# EAGLE design W520B (EAGLE 6.6.0)
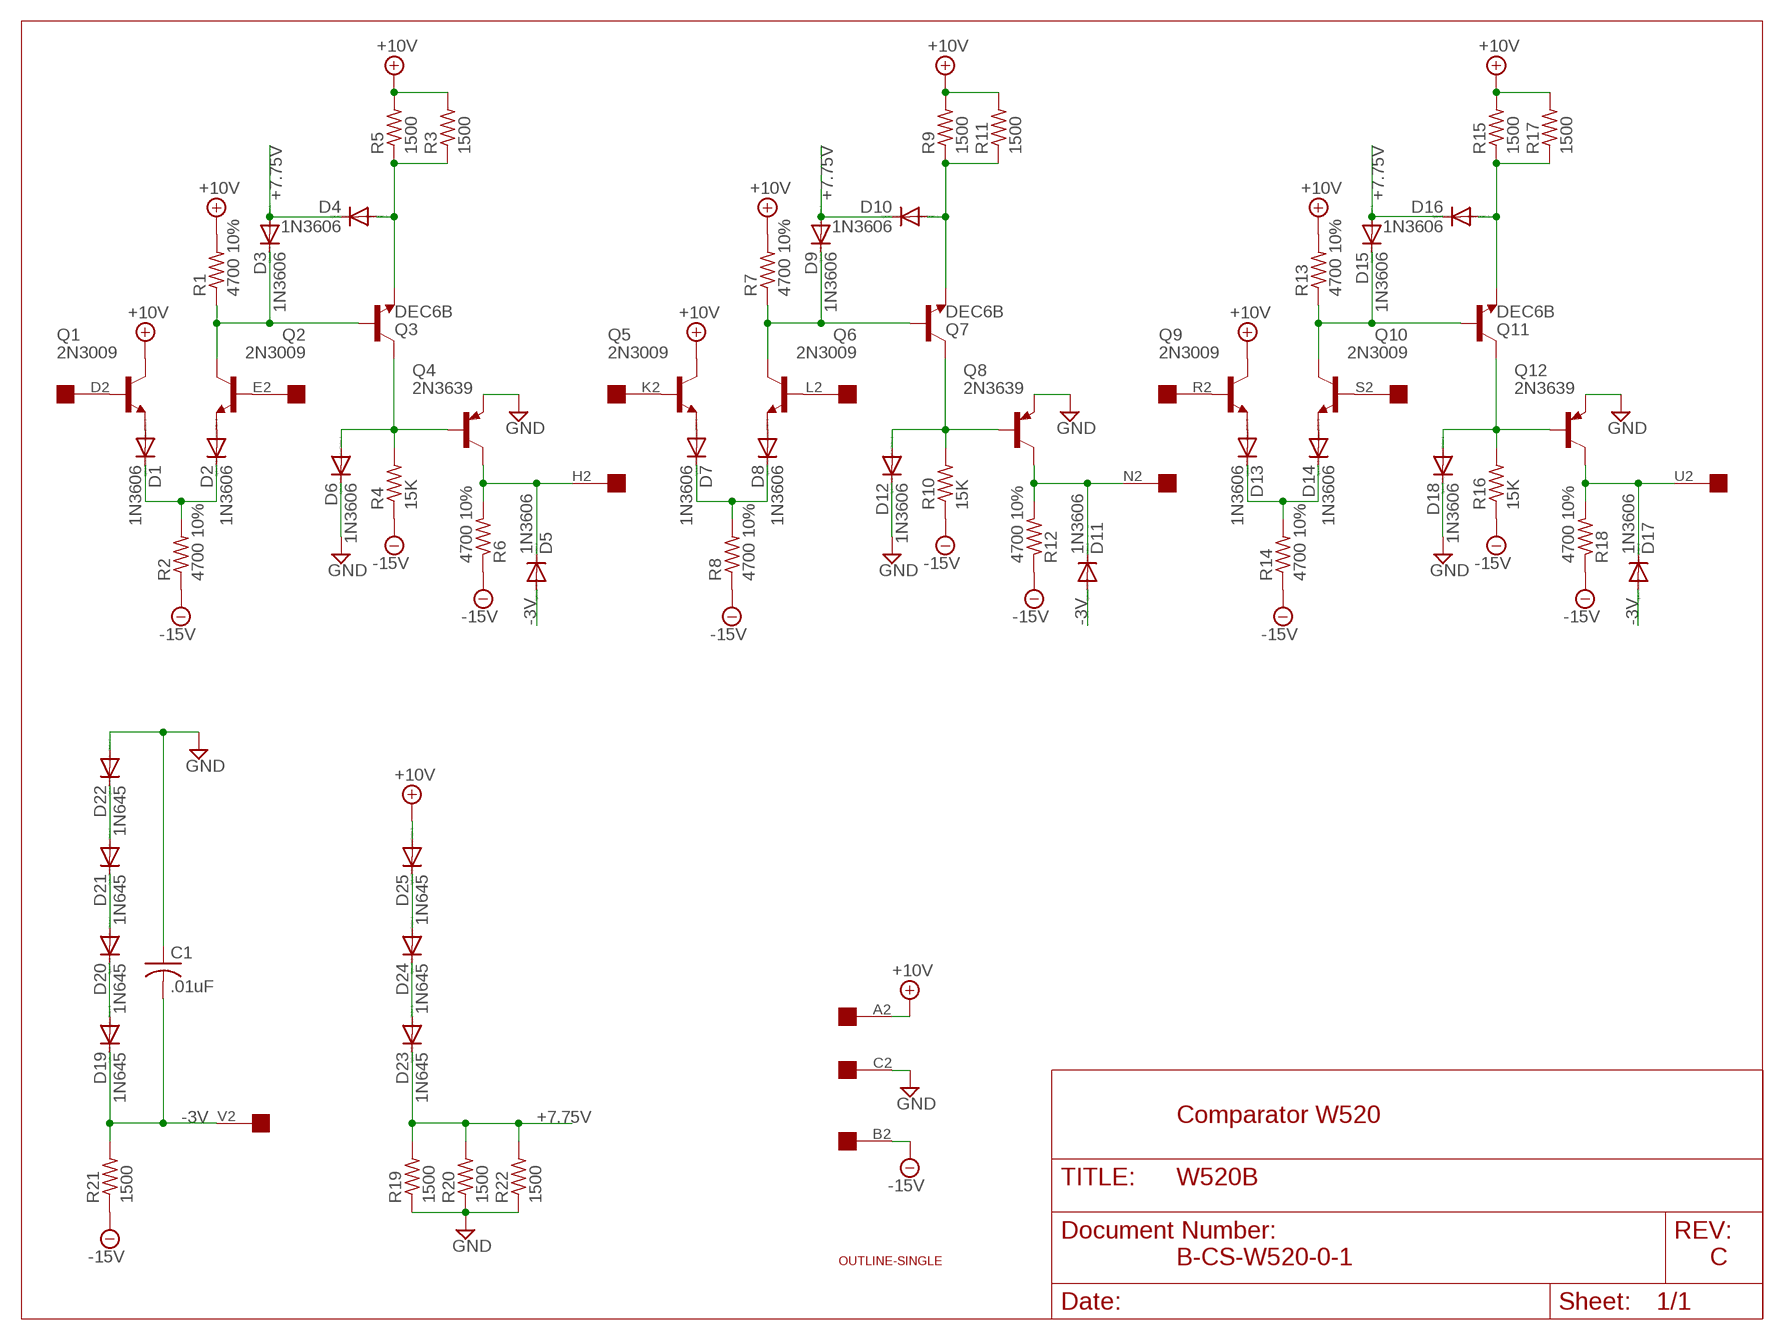
[diagram p0: schematic, sheet 1]

## Parts
C1  .01uF  C-US150-054X183  [C150-054X183]
D1  1N3606  1N4148DO35-10  [DO35-10]
D2  1N3606  1N4148DO35-10  [DO35-10]
D3  1N3606  1N4148DO35-10  [DO35-10]
D4  1N3606  1N4148DO35-10  [DO35-10]
D5  1N3606  1N4148DO35-10  [DO35-10]
D6  1N3606  1N4148DO35-10  [DO35-10]
D7  1N3606  1N4148DO35-10  [DO35-10]
D8  1N3606  1N4148DO35-10  [DO35-10]
D9  1N3606  1N4148DO35-10  [DO35-10]
D10  1N3606  1N4148DO35-10  [DO35-10]
D11  1N3606  1N4148DO35-10  [DO35-10]
D12  1N3606  1N4148DO35-10  [DO35-10]
D13  1N3606  1N4148DO35-10  [DO35-10]
D14  1N3606  1N4148DO35-10  [DO35-10]
D15  1N3606  1N4148DO35-10  [DO35-10]
D16  1N3606  1N4148DO35-10  [DO35-10]
D17  1N3606  1N4148DO35-10  [DO35-10]
D18  1N3606  1N4148DO35-10  [DO35-10]
D19  1N645  1N4148DO35-10  [DO35-10]
D20  1N645  1N4148DO35-10  [DO35-10]
D21  1N645  1N4148DO35-10  [DO35-10]
D22  1N645  1N4148DO35-10  [DO35-10]
D23  1N645  1N4148DO35-10  [DO35-10]
D24  1N645  1N4148DO35-10  [DO35-10]
D25  1N645  1N4148DO35-10  [DO35-10]
Q1  2N3009  2N2102  [TO5]
Q2  2N3009  2N2102  [TO5]
Q3  DEC6B  2N2102  [TO5]
Q4  2N3639  2N2904  [TO39]
Q5  2N3009  2N2102  [TO5]
Q6  2N3009  2N2102  [TO5]
Q7  DEC6B  2N2102  [TO5]
Q8  2N3639  2N2904  [TO39]
Q9  2N3009  2N2102  [TO5]
Q10  2N3009  2N2102  [TO5]
Q11  DEC6B  2N2102  [TO5]
Q12  2N3639  2N2904  [TO39]
R1  4700 10%  R-US_0207/10  [0207/10]
R2  4700 10%  R-US_0207/10  [0207/10]
R3  1500  R-US_0207/10  [0207/10]
R4  15K  R-US_0207/10  [0207/10]
R5  1500  R-US_0207/10  [0207/10]
R6  4700 10%  R-US_0207/10  [0207/10]
R7  4700 10%  R-US_0207/10  [0207/10]
R8  4700 10%  R-US_0207/10  [0207/10]
R9  1500  R-US_0207/10  [0207/10]
R10  15K  R-US_0207/10  [0207/10]
R11  1500  R-US_0207/10  [0207/10]
R12  4700 10%  R-US_0207/10  [0207/10]
R13  4700 10%  R-US_0207/10  [0207/10]
R14  4700 10%  R-US_0207/10  [0207/10]
R15  1500  R-US_0207/10  [0207/10]
R16  15K  R-US_0207/10  [0207/10]
R17  1500  R-US_0207/10  [0207/10]
R18  4700 10%  R-US_0207/10  [0207/10]
R19  1500  R-US_0207/10  [0207/10]
R20  1500  R-US_0207/10  [0207/10]
R21  1500  R-US_0207/10  [0207/10]
R22  1500  R-US_0207/10  [0207/10]
U$1  OUTLINE-SINGLE  [SINGLE]
U$2  EDGE-1  [EDGE-CON1]

## Nets
+7.75V: D3.A D4.C D9.A D10.C D15.A D16.C D23.C R19.2 R20.2 R22.2
+10V [Supply]: D25.A Q1.3(C) Q5.3(C) Q9.3(C) R1.2 R3.2 R5.2 R7.2 R9.2 R11.2 R13.2 R15.2 R17.2 U$2.A2
-3V: C1.2 D5.A D11.A D17.A D19.C R21.2 U$2.V2
-15V: R2.1 R4.1 R6.1 R8.1 R10.1 R12.1 R14.1 R16.1 R18.1 R21.1 U$2.B2
GND [Supply]: C1.1 D6.C D12.C D18.C D22.A Q4.1(E) Q8.1(E) Q12.1(E) R19.1 R20.1 R22.1 U$2.C2
N$1: D20.A D21.C
N$2: Q1.2(B) U$2.D2
N$3: Q2.2(B) U$2.E2
N$4: D1.A Q1.1(E)
N$5: D2.A Q2.1(E)
N$6: D1.C D2.C R2.2
N$7: D4.A Q3.1(E) R3.1 R5.1
N$8: D3.C Q2.3(C) Q3.2(B) R1.1
N$9: D5.C Q4.3(C) R6.2 U$2.H2
N$10: D6.A Q3.3(C) Q4.2(B) R4.2
N$11: Q5.2(B) U$2.K2
N$12: Q6.2(B) U$2.L2
N$13: D7.A Q5.1(E)
N$14: D8.A Q6.1(E)
N$15: D7.C D8.C R8.2
N$16: D10.A Q7.1(E) R9.1 R11.1
N$17: D9.C Q6.3(C) Q7.2(B) R7.1
N$18: D12.A Q7.3(C) Q8.2(B) R10.2
N$19: D11.C Q8.3(C) R12.2 U$2.N2
N$20: Q9.2(B) U$2.R2
N$21: Q10.2(B) U$2.S2
N$22: D13.A Q9.1(E)
N$23: D14.A Q10.1(E)
N$24: D13.C D14.C R14.2
N$25: D16.A Q11.1(E) R15.1 R17.1
N$26: D15.C Q10.3(C) Q11.2(B) R13.1
N$27: D21.A D22.C
N$28: D18.A Q11.3(C) Q12.2(B) R16.2
N$29: D19.A D20.C
N$30: D17.C Q12.3(C) R18.2 U$2.U2
N$31: D24.A D25.C
N$32: D23.A D24.C
Unconnected: U$2.F2 U$2.J2 U$2.M2 U$2.P2 U$2.T2

## Notes on the sheet
- Comparator W520
- B-CS-W520-0-1 | C

## Library data of the parts
C1 = rcl:C-US: CAPACITOR, American symbol
D1-D25 = diode:1N4148: DIODE high speed (Philips)
Q1-Q3 Q5-Q7 Q9-Q11 = transistor:2N2102: NPN TRANSISTOR
Q4 Q8 Q12 = transistor-pnp:2N2904*: PNP Transistror
R1-R22 = rcl:R-US_: RESISTOR, American symbol
U$1 = dec-con:OUTLINE-*: Board outlines for DEC boards.
U$2 = dec-con:EDGE-1: Single-Sided DEC Edge Connector -- (side 2)

## Net classes
1 Supply: width 0.813 mm

## Board
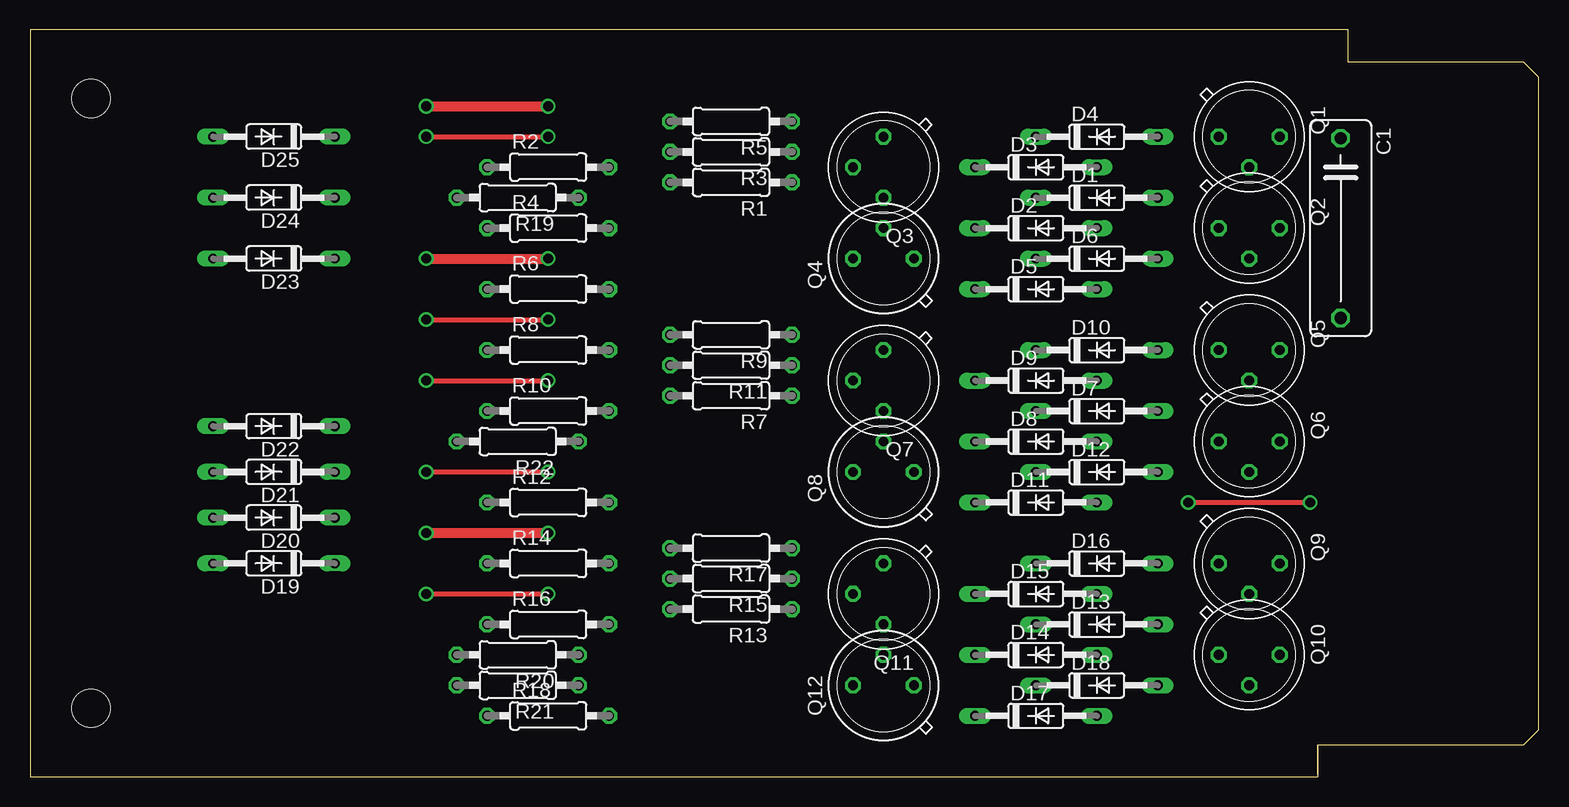
[diagram p1: board, top side]
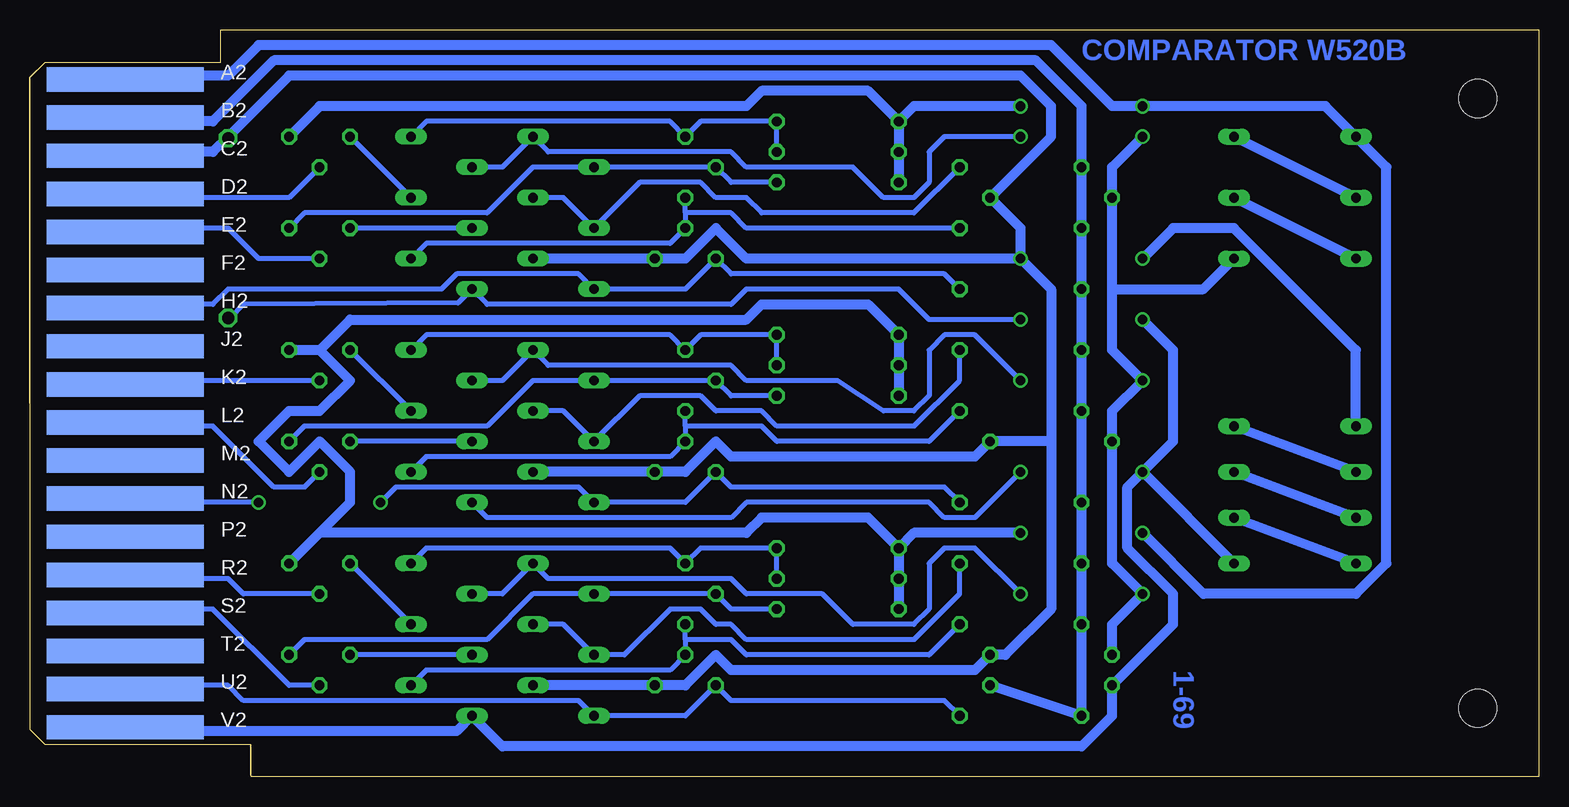
[diagram p2: board, bottom side, seen from below]

Size 125.73 x 62.23 mm. Coordinates in mm from the lower left corner, seen from the top.
Copper layers (1+16): Top 0.035mm / dielectric 1.5mm / Bottom 0.035mm
Design rules "16mils": minimum track width 16mil, minimum drill 32mil, track to track 15mil, track to pad 10mil, pad to pad 10mil, via to via 10mil, smd to smd 10mil, copper to edge 13mil, drill to drill 10mil, minimum pad ring 10mil, minimum via ring 8mil, stop-mask expansion 0mil, vias tented up to drill 0mil, thermal gap 10mil

### Footprints (pad centres in the part's own frame; a part is rotated, then mirrored left to right if it is on the bottom)
C150-054X183 = drill 1.016 octagon: 1 -7.493,0; 2 7.493,0
DO35-10 = drill 0.813 long: A 5.08,0; C -5.08,0
TO5 = drill 0.813 octagon: 1 0,-2.54; 2 2.54,0; 3 0,2.54
TO39 = drill 0.813 octagon: 1 0,-2.54; 2 2.54,0; 3 0,2.54
0207/10 = drill 0.813 octagon: 1 -5.08,0; 2 5.08,0
SINGLE = hole 3.175: 120.65,56.515; 120.65,5.715
EDGE-CON1 = smd 13.106 x 2.032 bottom: A2 7.938,4.128; B2 7.938,7.303; C2 7.938,10.477; D2 7.938,13.652; E2 7.938,16.828; F2 7.938,20.003; H2 7.938,23.177; J2 7.938,26.352; K2 7.938,29.527; L2 7.938,32.703; M2 7.938,35.877; N2 7.938,39.053; P2 7.938,42.227; R2 7.938,45.403; S2 7.938,48.578; T2 7.938,51.752; U2 7.938,54.928; V2 7.938,58.102

### Placement (x,y rotation side)
C1  109.22,45.72 270 top
D1  88.9,48.26 0 top
D2  83.82,45.72 0 top
D3  83.82,50.8 0 top
D4  88.9,53.34 0 top
D5  83.82,40.64 0 top
D6  88.9,43.18 0 top
D7  88.9,30.48 0 top
D8  83.82,27.94 0 top
D9  83.82,33.02 0 top
D10  88.9,35.56 0 top
D11  83.82,22.86 0 top
D12  88.9,25.4 0 top
D13  88.9,12.7 0 top
D14  83.82,10.16 0 top
D15  83.82,15.24 0 top
D16  88.9,17.78 0 top
D17  83.82,5.08 0 top
D18  88.9,7.62 0 top
D19  20.32,17.78 180 top
D20  20.32,21.59 180 top
D21  20.32,25.4 180 top
D22  20.32,29.21 180 top
D23  20.32,43.18 180 top
D24  20.32,48.26 180 top
D25  20.32,53.34 180 top
Q1  101.6,53.34 270 top
Q2  101.6,45.72 270 top
Q3  71.12,50.8 180 top
Q4  71.12,43.18 90 top
Q5  101.6,35.56 270 top
Q6  101.6,27.94 270 top
Q7  71.12,33.02 180 top
Q8  71.12,25.4 90 top
Q9  101.6,17.78 270 top
Q10  101.6,10.16 270 top
Q11  71.12,15.24 180 top
Q12  71.12,7.62 90 top
R1  58.42,49.53 180 top
R2  43.18,50.8 0 top
R3  58.42,52.07 180 top
R4  43.18,45.72 0 top
R5  58.42,54.61 180 top
R6  43.18,40.64 0 top
R7  58.42,31.75 180 top
R8  43.18,35.56 0 top
R9  58.42,36.83 180 top
R10  43.18,30.48 0 top
R11  58.42,34.29 180 top
R12  43.18,22.86 0 top
R13  58.42,13.97 180 top
R14  43.18,17.78 0 top
R15  58.42,16.51 180 top
R16  43.18,12.7 0 top
R17  58.42,19.05 180 top
R18  43.18,5.08 0 top
R19  40.64,48.26 180 top
R20  40.64,10.16 180 top
R21  40.64,7.62 180 top
R22  40.64,27.94 180 top
U$1  125.73,62.23 180 top
U$2  125.73,62.23 180 top

### Tracks (layer width: path | path; a pad name or v marks a point on that pad's centre or on a via)
+7.75V  (via drill 0.81)
  Top 0.406: v33.02,15.24 v43.18,15.24 | v33.02,53.34 v43.18,53.34 | v33.02,33.02 v43.18,33.02
  Bottom 0.406: v43.18,15.24 46.99,19.05 49.53,19.05 50.8,17.78 50.8,13.97 52.07,12.7 57.15,12.7 59.69,15.24 66.04,15.24 67.31,16.51 82.55,16.51 D16.C 86.36,15.24 D15.A | D9.A 86.36,33.02 D10.C 82.55,34.29 67.31,34.29 66.04,33.02 58.42,33.02 54.61,30.48 52.07,30.48 50.8,31.75 50.8,35.56 49.53,36.83 46.99,36.83 v43.18,33.02 | D3.A 86.36,50.8 D4.C 82.55,52.07 67.31,52.07 66.04,50.8 57.15,50.8 54.61,48.26 52.07,48.26 50.8,49.53 50.8,52.07 49.53,53.34 v43.18,53.34
  Bottom 0.813: R20.2 35.56,12.7 v33.02,15.24 35.56,17.78 R22.2 35.56,30.48 v33.02,33.02 35.56,35.56 35.56,40.64 | v33.02,53.34 35.56,50.8 R19.2 35.56,40.64 | D23.C 27.94,40.64 35.56,40.64
+10V  (via drill 0.81)
  Top 0.813: v33.02,20.32 v43.18,20.32 | v33.02,55.88 v43.18,55.88
  Bottom 0.813: 101.6,20.32 Q9.3 | 101.6,20.32 99.06,22.86 99.06,25.4 101.6,27.94 104.14,25.4 106.68,27.94 104.14,30.48 101.6,30.48 99.06,33.02 101.6,35.56 | 101.6,35.56 Q5.3 | R17.2 R15.2 R13.2 | R7.2 R11.2 R9.2 55.88,39.37 64.77,39.37 66.04,38.1 99.06,38.1 101.6,35.56 | R5.2 R3.2 R1.2 | R17.2 55.88,21.59 64.77,21.59 66.04,20.32 101.6,20.32 | R17.2 52.07,20.32 v43.18,20.32 | U$2.A2 117.22,58.04 116.84,58.42 109.22,58.42 106.68,60.96 40.64,60.96 35.56,55.88 v33.02,55.88 17.78,55.88 D25.A 12.7,50.8 12.7,17.78 15.24,15.24 27.94,15.24 v33.02,20.32 | Q1.3 101.6,55.88 66.04,55.88 64.77,57.15 55.88,57.15 R5.2 | R5.2 52.07,55.88 v43.18,55.88
-3V  (via drill 0.81)
  Top 0.406: v33.02,25.4 v43.18,25.4 | v33.02,38.1 v43.18,38.1
  Bottom 0.406: C1.2 109.09,38.23 107.95,39.37 90.04,39.5 D5.A 87.63,39.37 67.31,39.37 66.04,40.64 53.34,40.64 50.8,38.1 v43.18,38.1 | D11.A 87.63,21.59 67.31,21.59 66.04,22.86 50.8,22.86 49.53,21.59 46.99,21.59 v43.18,25.4
  Bottom 0.813: U$2.V2 117.16,4.13 116.84,3.81 90.17,3.81 D17.A 86.36,2.54 38.1,2.54 35.56,5.08 R21.2 30.48,12.7 30.48,15.24 34.29,19.05 34.29,24.13 v33.02,25.4 | v33.02,25.4 D19.C | v33.02,25.4 30.48,27.94 30.48,35.56 v33.02,38.1
-15V
  Bottom 0.813: R21.1 R18.1 R16.1 R14.1 R12.1 R10.1 R8.1 R6.1 R4.1 R2.1 38.1,55.88 41.91,59.69 105.41,59.69 110.49,54.61 115.57,54.61 115.86,54.9 U$2.B2
GND  (via drill 0.81)
  Top 0.813: v33.02,43.18 v43.18,43.18
  Bottom 0.813: D18.C Q12.1 71.12,7.62 68.58,10.16 67.31,8.89 46.99,8.89 R20.1 44.45,10.16 40.64,13.97 40.64,27.94 | 40.64,27.94 R22.1 46.99,26.67 67.31,26.67 68.58,27.94 71.12,25.4 Q8.1 D12.C | U$2.C2 117.17,51.74 116.84,52.07 110.49,52.07 109.22,53.34 | 109.22,53.34 C1.1 | 109.22,53.34 104.14,58.42 43.18,58.42 40.64,55.88 40.64,53.34 R19.1 43.18,45.72 v43.18,43.18 | v43.18,43.18 40.64,40.64 40.64,27.94 | D22.A 15.24,35.56 25.4,45.72 30.48,45.72 v33.02,43.18 | D6.C Q4.1 71.12,43.18 68.58,45.72 66.04,43.18 v43.18,43.18
N$1
  Bottom 0.813: D20.A D21.C
N$2
  Bottom 0.406: U$2.D2 117.14,48.56 116.84,48.26 104.14,48.26 Q1.2
N$3
  Bottom 0.406: U$2.E2 117.17,45.39 116.84,45.72 109.22,45.72 106.68,43.18 Q2.2
N$4
  Bottom 0.406: D1.A Q1.1
N$5
  Bottom 0.406: D2.A Q2.1
N$6
  Bottom 0.406: R2.2 52.07,46.99 64.77,46.99 66.04,48.26 68.58,48.26 69.85,49.53 74.93,49.53 D2.C 81.28,48.26 D1.C
N$7
  Bottom 0.406: R3.1 R5.1 69.85,54.61 Q3.1 72.39,54.61 92.71,54.61 D4.A
N$8
  Bottom 0.406: Q2.3 102.87,46.99 87.63,46.99 83.82,50.8 D3.C Q3.2 67.31,49.53 R1.1
N$9
  Bottom 0.406: U$2.H2 115.9,39.04 115.57,39.37 110.49,39.37 109.22,40.64 91.44,40.64 90.17,41.91 80.01,41.91 D5.C 71.12,40.64 Q4.3 67.31,41.91 49.53,41.91 R6.2
N$10
  Bottom 0.406: 71.12,46.99 Q4.2 72.39,44.45 92.71,44.45 D6.A | 71.12,46.99 Q3.3 | R4.2 66.04,45.72 67.31,46.99 71.12,46.99
N$11
  Bottom 0.406: U$2.K2 117.14,32.72 116.84,33.02 Q5.2
N$12
  Bottom 0.406: U$2.L2 117.17,29.54 116.84,29.21 110.49,29.21 105.41,24.13 102.87,24.13 Q6.2
N$13
  Bottom 0.406: D7.A Q5.1
N$14
  Bottom 0.406: D8.A Q6.1
N$15
  Bottom 0.406: R8.2 48.26,33.02 52.07,29.21 63.5,29.21 64.77,30.48 68.58,30.48 69.85,31.75 74.93,31.75 D8.C 81.28,30.48 D7.C
N$16
  Bottom 0.406: R11.1 R9.1 69.85,36.83 Q7.1 72.39,36.83 92.71,36.83 D10.A
N$17
  Bottom 0.406: R7.1 67.31,31.75 Q7.2 D9.C 83.82,33.02 87.63,29.21 102.87,29.21 Q6.3
N$18
  Bottom 0.406: R10.2 50.8,27.94 63.5,27.94 64.77,29.21 71.12,29.21 | 71.12,29.21 Q8.2 72.39,26.67 92.71,26.67 D12.A | 71.12,29.21 Q7.3
N$19  (via drill 0.81)
  Top 0.406: v96.52,22.86 v106.68,22.86
  Bottom 0.406: U$2.N2 117.17,23.19 116.84,22.86 v106.68,22.86 | v96.52,22.86 95.25,24.13 80.01,24.13 D11.C 71.12,22.86 Q8.3 67.31,24.13 49.53,24.13 R12.2
N$20
  Bottom 0.406: U$2.R2 117.17,16.84 116.84,16.51 109.22,16.51 107.95,15.24 Q9.2
N$21
  Bottom 0.406: U$2.S2 117.14,13.66 116.84,13.97 110.49,13.97 104.14,7.62 Q10.2
N$22
  Bottom 0.406: D13.A Q9.1
N$23
  Bottom 0.406: D14.A Q10.1
N$24
  Bottom 0.406: D13.C 81.28,12.7 D14.C 76.2,10.16 72.39,13.97 69.85,13.97 68.58,12.7 67.31,12.7 66.04,11.43 52.07,11.43 48.26,15.24 R14.2
N$25
  Bottom 0.406: R15.1 R17.1 69.85,19.05 Q11.1 72.39,19.05 92.71,19.05 D16.A
N$26
  Bottom 0.406: Q10.3 102.87,11.43 87.63,11.43 83.82,15.24 D15.C Q11.2 67.31,13.97 R13.1
N$27
  Bottom 0.813: D21.A D22.C
N$28
  Bottom 0.406: 71.12,11.43 Q12.2 72.39,8.89 92.71,8.89 D18.A | 71.12,11.43 Q11.3 | R16.2 50.8,10.16 66.04,10.16 67.31,11.43 71.12,11.43
N$29
  Bottom 0.813: D19.A D20.C
N$30
  Bottom 0.406: U$2.U2 117.2,7.26 116.84,7.62 109.22,7.62 107.95,6.35 80.01,6.35 D17.C 71.12,5.08 Q12.3 67.31,6.35 49.53,6.35 R18.2
N$31
  Bottom 0.813: D24.A D25.C
N$32
  Bottom 0.813: D23.A D24.C

### Text on the board
Bottom: COMPARATOR W520B | 1-69